# Altium schematic sheet sch_AGV_Header.SchDoc
size A; SheetNumber: 6; SheetTotal: 6
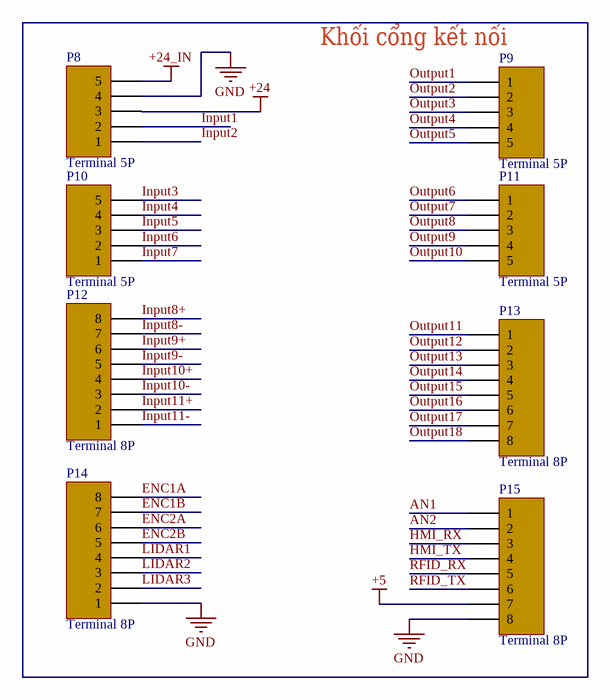
[diagram p0: sch_AGV_Header.SchDoc]

## Parts
P8  Terminal 5P  [BIG_Header 5]
P9  Terminal 5P  [BIG_Header 5]
P10  Terminal 5P  [BIG_Header 5]
P11  Terminal 5P  [BIG_Header 5]
P12  Terminal 8P  [BIG_Header 8]
P13  Terminal 8P  [BIG_Header 8]
P14  Terminal 8P  [BIG_Header 8]
P15  Terminal 8P  [BIG_Header 8]

## Nets
+5: P15.7
+24: P8.3
+24_IN: P8.5
GND: P8.4 P14.1 P15.8
AN1: P15.1
AN2: P15.2
ENC1A: P14.8
ENC1B: P14.7
ENC2A: P14.6
ENC2B: P14.5
HMI_RX: P15.3
HMI_TX: P15.4
Input1: P8.2
Input2: P8.1
Input3: P10.5
Input4: P10.4
Input5: P10.3
Input6: P10.2
Input7: P10.1
Input8+: P12.8
Input8-: P12.7
Input9+: P12.6
Input9-: P12.5
Input10+: P12.4
Input10-: P12.3
Input11+: P12.2
Input11-: P12.1
LIDAR1: P14.4
LIDAR2: P14.3
LIDAR3: P14.2
Output1: P9.1
Output2: P9.2
Output3: P9.3
Output4: P9.4
Output5: P9.5
Output6: P11.1
Output7: P11.2
Output8: P11.3
Output9: P11.4
Output10: P11.5
Output11: P13.1
Output12: P13.2
Output13: P13.3
Output14: P13.4
Output15: P13.5
Output16: P13.6
Output17: P13.7
Output18: P13.8
RFID_RX: P15.5
RFID_TX: P15.6

## Notes on the sheet
- (near P9) Khối cổng kết nối

## Library data of the parts
P8-P11 = Terminal 5P: Terminal 5.08m; LatestRevisionDate: 17-Jul-2002; LatestRevisionNote: Re-released for DXP Platform.; Publisher: Altium Limited
P12-P15 = Terminal 8P: Terminal 5.08; LatestRevisionDate: 17-Jul-2002; LatestRevisionNote: Re-released for DXP Platform.; Publisher: Altium Limited